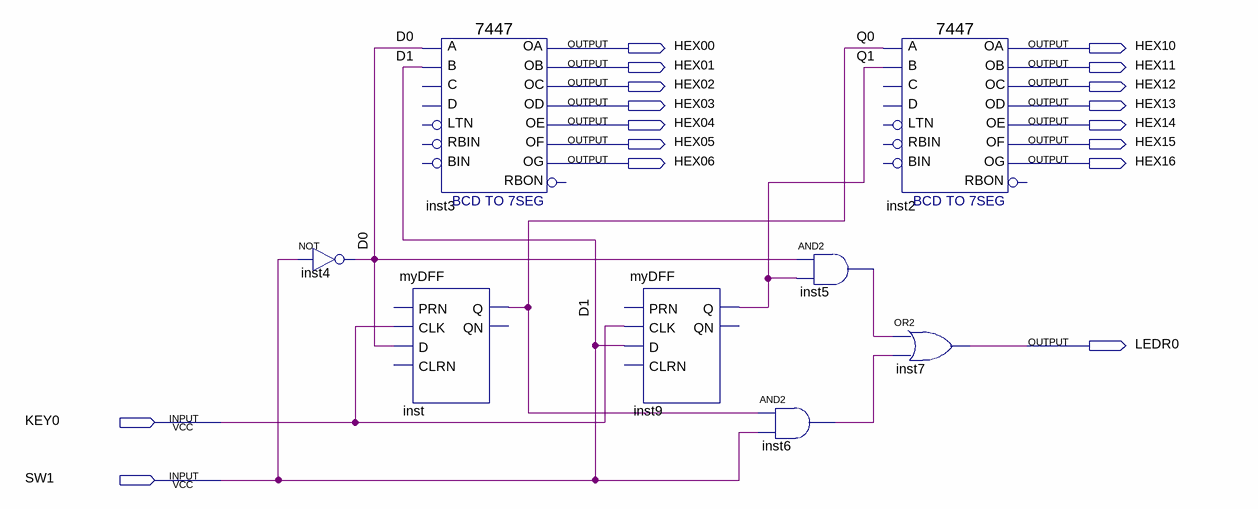
[diagram p0: schematic sheet]
// Quartus schematic LAB02MEALY.bdf as structural Verilog: 8 symbols, 17 pins
module LAB02MEALY (
  input  KEY0,
  input  SW1,
  output HEX00,
  output HEX10,
  output HEX01,
  output HEX11,
  output HEX02,
  output HEX12,
  output HEX03,
  output HEX13,
  output HEX04,
  output HEX14,
  output HEX05,
  output HEX15,
  output HEX06,
  output HEX16,
  output LEDR0
);

  wire D0, inst5_out, inst6_out, Q0, Q1;

  not inst4 (D0, SW1);
  \7447  inst3 (
    .B(SW1), .A(D0), .OB(HEX01), .OC(HEX02), .OE(HEX04), .OD(HEX03), .OF(HEX05), .OG(HEX06), .OA(HEX00));  // open: LTN, C, D, RBIN, BIN, RBON
  myDFF inst (.CLK(KEY0), .D(D0), .Q(Q0));  // open: PRN, CLRN, QN
  myDFF inst9 (.CLK(KEY0), .D(SW1), .Q(Q1));  // open: PRN, CLRN, QN
  and inst6 (inst6_out, Q0, SW1);
  and inst5 (inst5_out, D0, Q1);
  \7447  inst2 (
    .B(Q1), .A(Q0), .OB(HEX11), .OC(HEX12), .OE(HEX14), .OD(HEX13), .OF(HEX15), .OG(HEX16), .OA(HEX10));  // open: LTN, C, D, RBIN, BIN, RBON
  or inst7 (LEDR0, inst5_out, inst6_out);

  // Other names for the same wires on the sheet: D1 = SW1
endmodule
